# EAGLE design lin.reg.schematic-powerpcb (EAGLE 8.4.0)
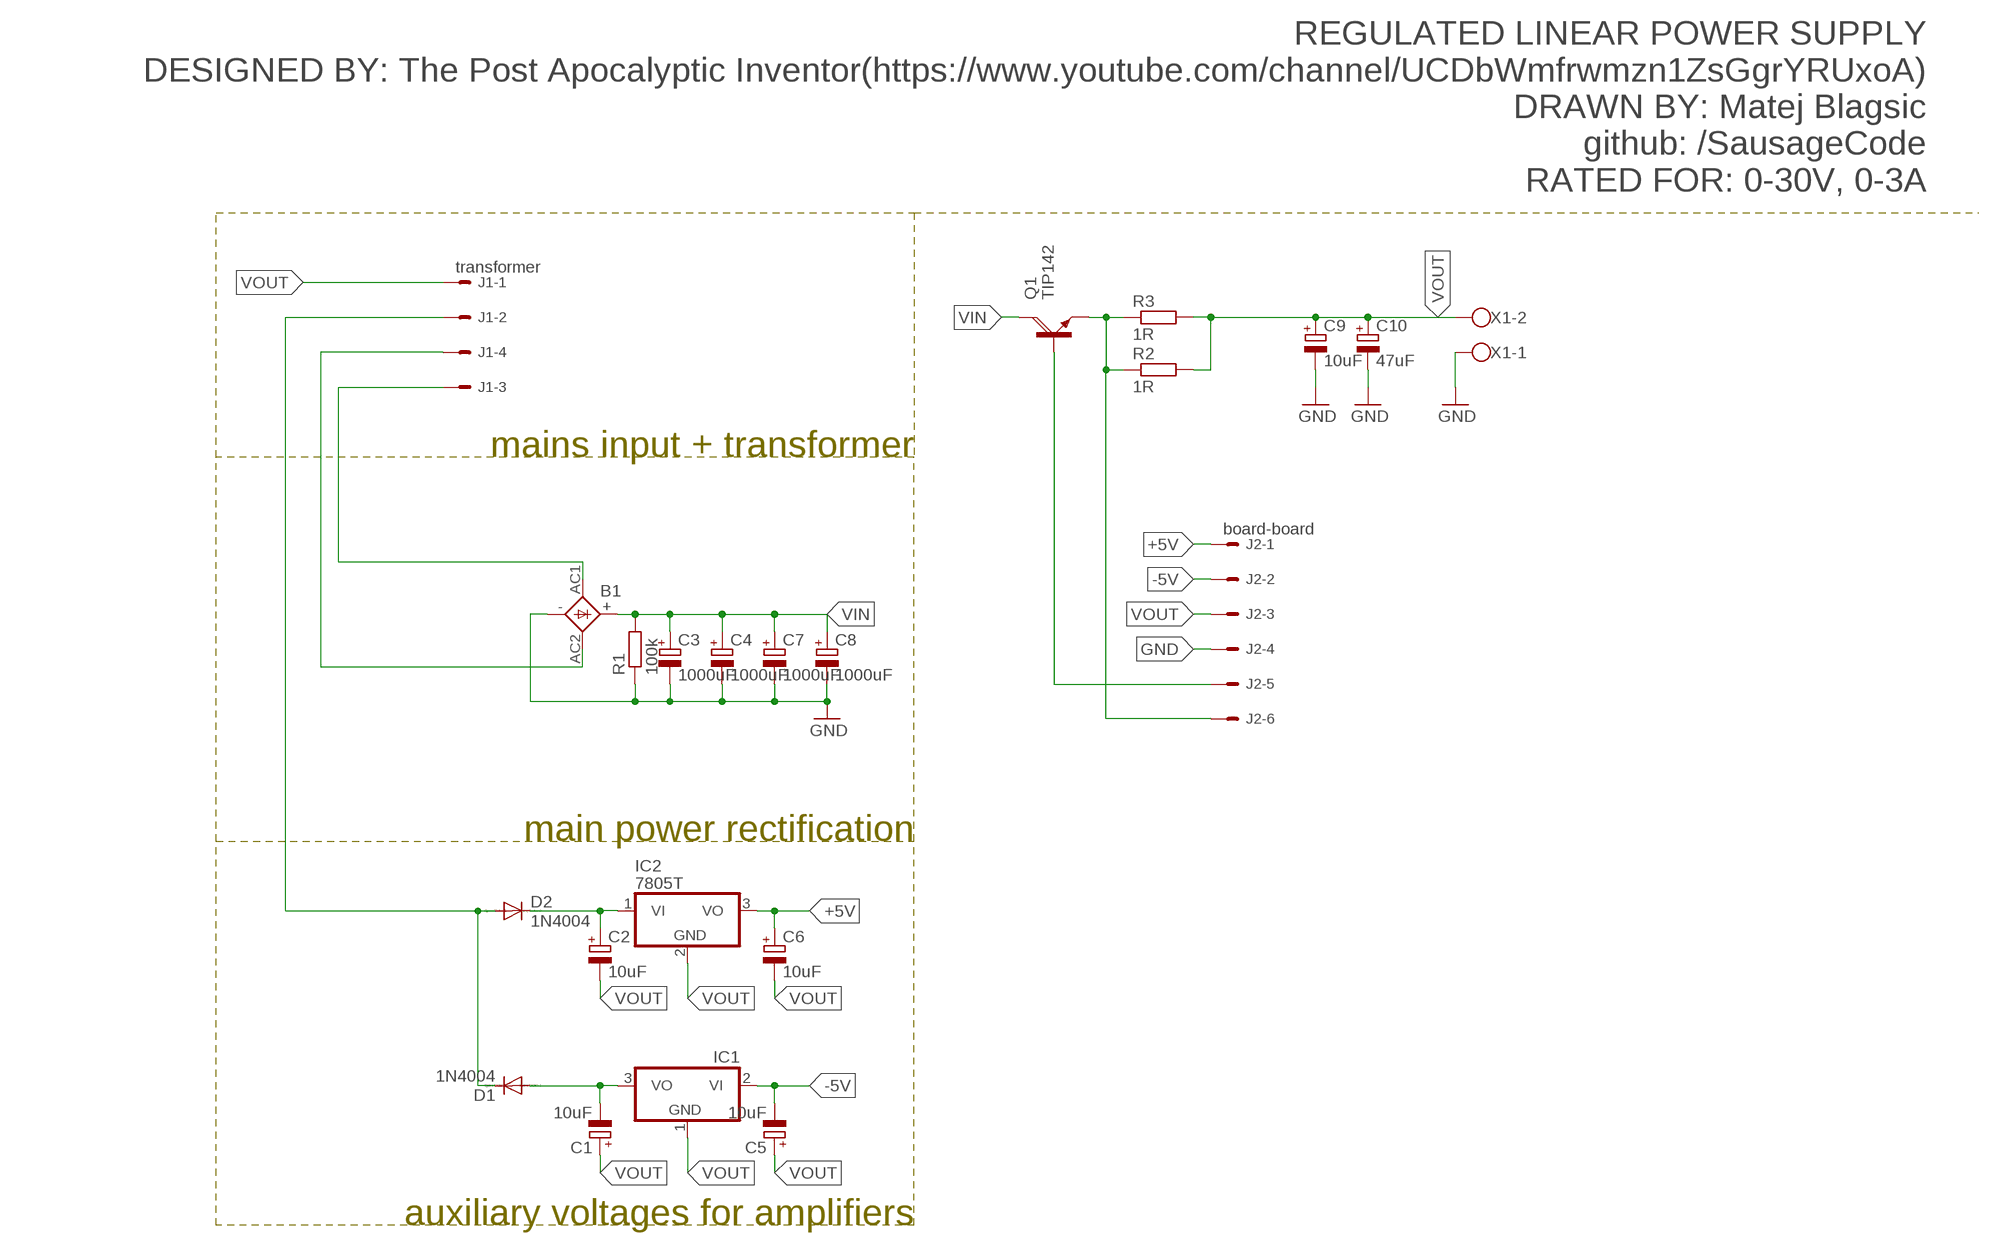
[diagram p0: schematic, sheet 1]

## Parts
B1  2KBB-R  [2KBB-R]
C1  10uF  CPOL-EUE2-5  [E2-5]
C2  10uF  CPOL-EUE2-5  [E2-5]
C3  1000uF  CPOL-EUE5-13  [E5-13]
C4  1000uF  CPOL-EUE5-13  [E5-13]
C5  10uF  CPOL-EUE2-5  [E2-5]
C6  10uF  CPOL-EUE2-5  [E2-5]
C7  1000uF  CPOL-EUE5-13  [E5-13]
C8  1000uF  CPOL-EUE5-13  [E5-13]
C9  10uF  CPOL-EUE2-5  [E2-5]
C10  47uF  CPOL-EUE2-5  [E2-5]
D1  1N4004  [DO41-10]
D2  1N4004  [DO41-10]
IC1  7905T  [TO220H]
IC2  7805T  [TO220H]
J1  transformer  22-27-2041-04  [6410-04]
J2  board-board  22-27-2061-06  [6410-06]
Q1  TIP142  [SOT93]
R1  100k  R-EU_0309/12  [0309/12]
R2  1R  R-EU_0922/22  [0922/22]
R3  1R  R-EU_0922/22  [0922/22]
X1  W237-102  [W237-102]

## Nets
+5V: C6.+ IC2.3(VO) J2.1
-5V: C5.- IC1.2(VI) J2.2
GND: B1.- C3.- C4.- C7.- C8.- C9.- C10.- J2.4 R1.1 X1.1
N$6: J2.6 Q1.E R2.1 R3.1
N$7: J2.5 Q1.B
N$18: C2.+ D2.C IC2.1(VI)
N$21: C1.- D1.A IC1.3(VO)
N$23: D1.C D2.A J1.2
N$24: B1.AC2 J1.4
N$29: B1.AC1 J1.3
VIN: B1.+ C3.+ C4.+ C7.+ C8.+ Q1.C R1.2
VOUT: C1.+ C2.- C5.+ C6.- C9.+ C10.+ IC1.1(GND) IC2.2(GND) J1.1 J2.3 R2.2 R3.2 X1.2

## Notes on the sheet
- REGULATED LINEAR POWER SUPPLY
  DESIGNED BY: The Post Apocalyptic Inventor(https://www.youtube.com/channel/UCDbWmfrwmzn1ZsGgrYRUxoA)
  DRAWN BY: Matej Blagsic
  github: /SausageCode
  RATED FOR: 0-30V, 0-3A
- mains input + transformer
- main power rectification
- auxiliary voltages for amplifiers

## Library data of the parts
B1 = rectifier:2KBB-R: RECTIFIER grid 3 x 5 mm
C1-C10 = rcl:CPOL-EU: POLARIZED CAPACITOR, European symbol
D1 D2 = diode:1N4004: DIODE general purpose rectifier, 1 A
IC1 = linear:79*: Negative VOLTAGE REGULATOR
IC2 = linear:78*: Positive VOLTAGE REGULATOR Source: http://cache.national.com/ds/LM/LM78L05.pdf http://www.fairchildsemi.com/ds/LM/LM7805.pdf
J1 = con-molex:22-?-04: CONNECTOR wire to board 2.54 mm (.1 inch) pitch header; OC_FARNELL: unknown; OC_NEWARK: unknown
J2 = con-molex:22-?-06: CONNECTOR wire to board 2.54 mm (.1 inch) pitch header; OC_FARNELL: unknown; OC_NEWARK: unknown
Q1 = transistor-power:TIP142: NPN DARLINGTON TRANSISTOR
R1 = rcl:R-EU_: RESISTOR, European symbol
R2 R3 = resistor:R-EU_: RESISTOR, European symbol
X1 = con-wago-500:W237-102: WAGO SCREW CLAMP; MPN: 237-102; OC_FARNELL: unknown; OC_NEWARK: 70K9898

## Board
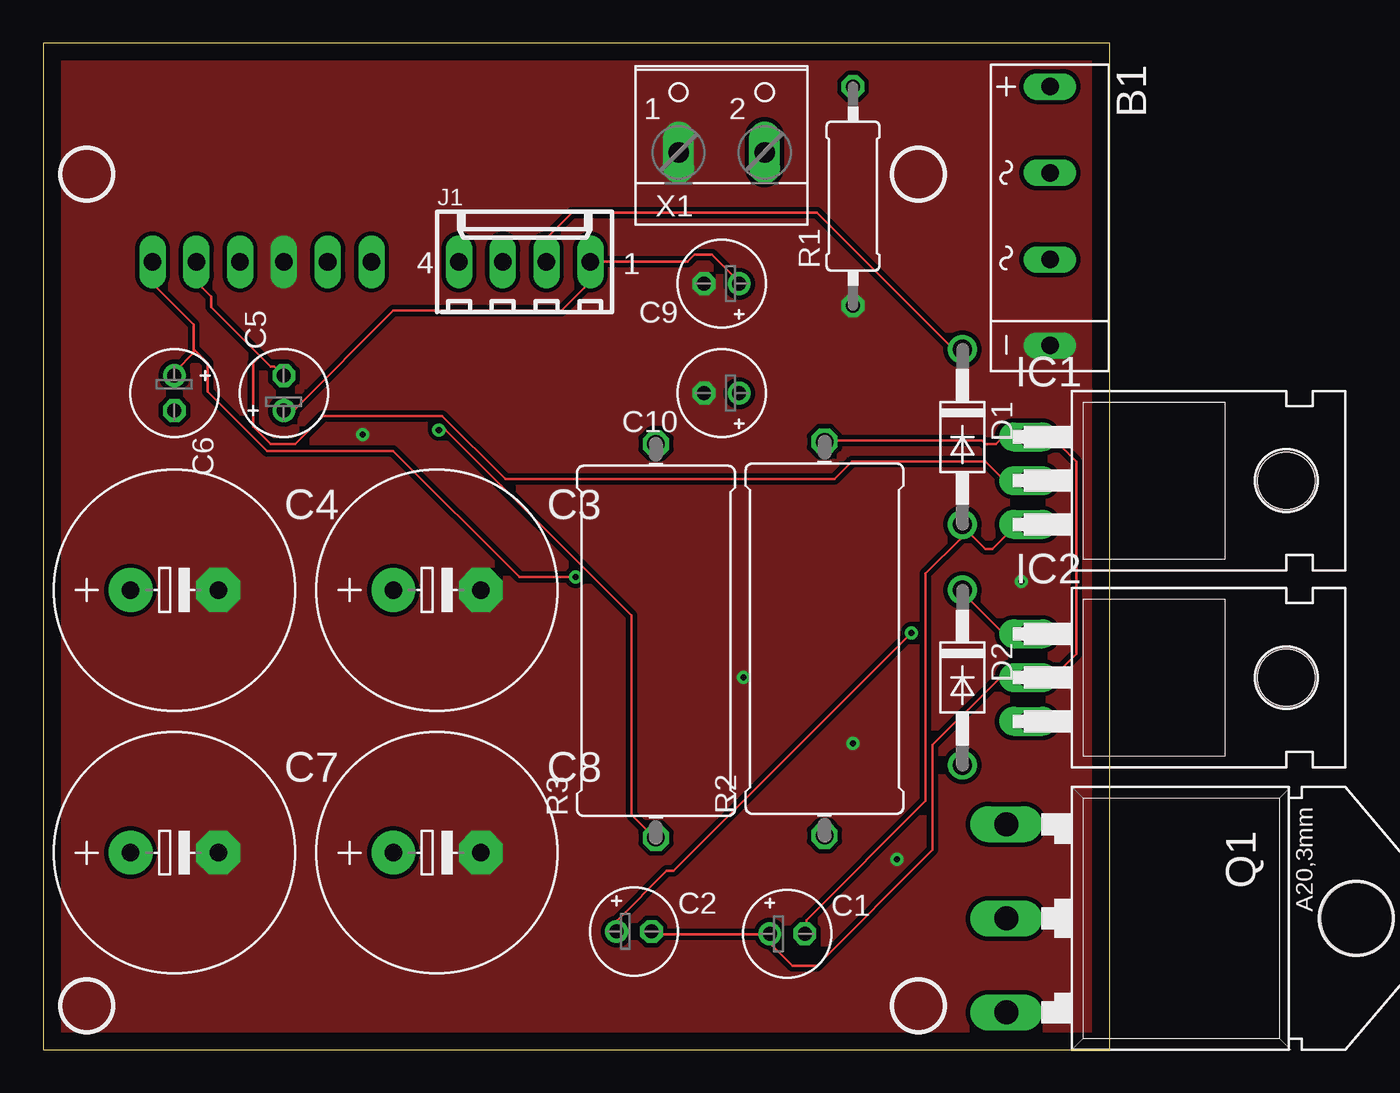
[diagram p1: board, top side]
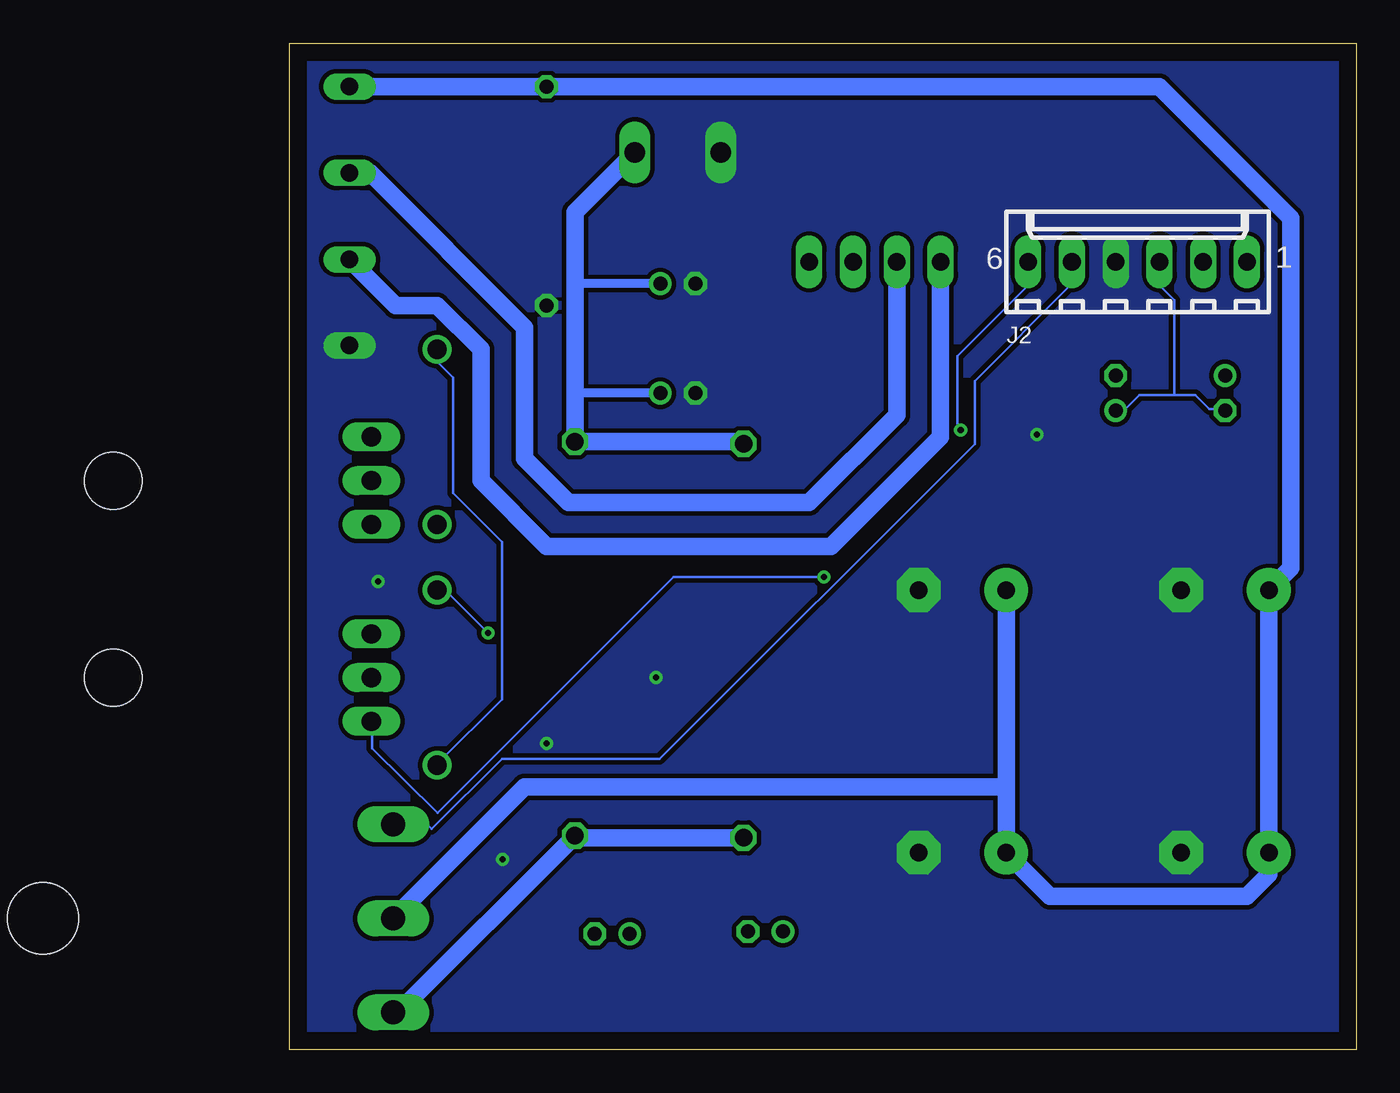
[diagram p2: board, bottom side, seen from below]

Size 61.9 x 58.41 mm. Coordinates in mm from the lower left corner, seen from the top.
Outline: 0,0 61.9,0 61.9,58.41 0,58.41 0,0
Copper layers (1*16): Top 0.035mm / dielectric 1.5mm / Bottom 0.035mm
Design rules "default *": minimum track width 6mil, minimum drill 0.35mm, track to track 10mil, track to pad 10mil, pad to pad 10mil, via to via 10mil, smd to smd 6mil, copper to edge 40mil, drill to drill 6mil, minimum pad ring 10mil, minimum via ring 8mil, stop-mask expansion 4mil, vias tented up to drill 0mil, thermal gap 0mil

### Footprints (pad centres in the part's own frame; a part is rotated, then mirrored left to right if it is on the bottom)
2KBB-R = drill 1.016 long: + -7.62,0; - 7.391,0; AC1 -2.616,0; AC2 2.413,0
E2-5 = drill 0.813 pad 1.27: + -1.016,0 | drill 0.813 pad 1.27 octagon: - 1.016,0
E5-13 = drill 1.016 pad 2.54: + -2.54,0 | drill 1.016 pad 2.54 octagon: - 2.54,0
DO41-10 = drill 1.118: A 5.08,0; C -5.08,0
TO220H = drill 1.118 long: 1 -2.54,-10.16; 2 0,-10.16; 3 2.54,-10.16 | hole 3.302: 0,4.826
6410-04 = drill 1.016 long: 1 3.81,0; 2 1.27,0; 3 -1.27,0; 4 -3.81,0
6410-06 = drill 1.016 long: 1 6.35,0; 2 3.81,0; 3 1.27,0; 4 -1.27,0; 5 -3.81,0; 6 -6.35,0
SOT93 = drill 1.397 long: B -5.461,-10.16; C 0,-10.16; E 5.461,-10.16 | hole 4.115: 0,10.16
0309/12 = drill 0.813 octagon: 1 -6.35,0; 2 6.35,0
0922/22 = drill 1.016 octagon: 1 -11.43,0; 2 11.43,0
W237-102 = drill 1.194 long: 1 -2.5,-1.27; 2 2.5,-1.27

### Placement (x,y rotation side)
B1  58.42,48.26 270 top
C1  43.18,6.73 0 top
C2  34.29,6.86 0 top
C3  22.86,26.67 0 top
C4  7.62,26.67 0 top
C5  13.97,38.1 90 top
C6  7.62,38.1 270 top
C7  7.62,11.43 0 top
C8  22.86,11.43 0 top
C9  39.37,44.45 180 top
C10  39.37,38.1 180 top
D1  53.34,35.56 270 top
D2  53.34,21.59 270 top
IC1  67.31,33.02 270 top
IC2  67.31,21.59 270 top
J1  27.94,45.72 0 top
J2  12.7,45.72 0 bottom
Q1  66.04,7.62 270 top
R1  46.99,49.53 90 top
R2  45.34,23.85 90 top
R3  35.56,23.72 90 top
X1  39.37,53.34 0 top

### Tracks (layer width: path | path; a pad name or v marks a point on that pad's centre or on a via)
+5V  (via drill 0.35)
  Top 0.152: 8.74,40.64 8.74,42.06 6.5,44.3 6.5,45.72 J2.1 | 8.74,40.64 8.74,40.44 7.72,39.42 7.72,39.22 C6.+ | v30.89,27.43 27.64,27.43 20.32,34.75 13.01,34.75 9.55,38.2 9.55,39.83 8.74,40.64
  Bottom 0.152: v30.89,27.43 39.62,27.43 53.31,13.74 57.1,17.48 57.1,18.9 IC2.3
-5V
  Top 0.152: 12.6,40.23 9.75,43.08 9.75,43.69 8.94,44.5 8.94,45.72 J2.2 | 12.6,40.23 13.21,39.62 13.41,39.62 13.82,39.22 C5.- | 12.6,40.23 12.19,39.83 12.19,36.17 13.21,35.15 14.63,35.15 16.26,36.78 23.16,36.78 26.82,33.12 45.92,33.12 46.94,34.14 54.66,34.14 55.68,33.12 57.1,33.12 IC1.2
GND  (via drill 0.35)
  other vias: 46.99,17.78 40.64,21.59 49.53,11.05 56.77,27.18 18.54,35.69
  pour Bottom: 0,58.42 62.23,58.42 62.23,0 0,0
  pour Top: 0,58.42 62.23,58.42 62.23,0 0,0
N$6  (via drill 0.35)
  Top 0.152: v22.96,35.97 23.37,35.97 34.14,25.2 34.14,13.61 35.56,12.19 R3.1
  Bottom 0.152: v22.96,35.97 23.16,36.17 23.16,40.23 19.1,44.3 19.1,45.72 J2.6
  Bottom 1.016: R3.1 45.21,12.29 R2.1 55.6,2.16 Q1.E
N$7
  Bottom 0.152: J2.5 16.66,45.72 16.66,44.3 22.15,38.81 22.15,35.15 40.44,16.87 49.58,16.87 53.65,12.8 53.85,13.01 55.88,13.01 Q1.B
N$18  (via drill 0.35)
  Top 0.152: v50.39,24.18 36.58,10.36 36.17,10.36 33.33,7.52 33.33,6.91 C2.+ | IC2.1 57.1,24.18 55.68,24.18 53.24,26.62 D2.C
  Bottom 0.152: v50.39,24.18 52.83,26.62 53.24,26.62 D2.C
N$21
  Top 0.152: 53.24,29.87 53.24,30.48 D1.A 53.24,29.87 | 53.24,29.87 53.24,29.67 51.21,27.64 51.21,14.43 44.3,7.52 44.3,6.91 C1.- | IC1.3 56.49,30.48 55.07,29.06 54.66,29.06 53.85,29.87 53.24,29.87
N$23
  Top 0.152: D1.C 52.83,40.64 44.91,48.56 30.68,48.56 29.26,47.14 29.26,45.72 J1.2
  Bottom 0.152: D2.A 53.24,16.66 49.58,20.32 49.58,29.46 52.43,32.31 52.43,39.01 53.24,39.83 53.24,40.64 D1.C
N$24
  Bottom 1.016: B1.AC2 55.75,43.18 53.34,43.18 50.8,40.64 50.8,33.02 46.99,29.21 30.48,29.21 24.13,35.56 J1.4
N$29
  Bottom 1.016: J1.3 26.67,36.83 31.75,31.75 45.72,31.75 48.26,34.29 48.26,41.91 57.23,50.88 B1.AC1
VIN
  Bottom 1.016: B1.+ R1.2 11.43,55.88 3.81,48.26 3.81,27.94 C4.+ C7.+ 5.08,10.16 6.35,8.89 17.78,8.89 C8.+ 20.32,15.24 | Q1.C 48.26,15.24 20.32,15.24 | C3.+ 20.32,15.24
VOUT
  Top 0.152: C9.+ 40.44,44.5 38.81,46.13 37.8,46.13 37.39,45.72 J1.1 31.7,45.72 31.7,44.5 30.07,42.88 20.32,42.88 14.63,37.19 14.02,37.19 C5.+ | C2.- 35.36,6.71 42.06,6.71 C1.+ 42.27,6.71 42.27,6.1 43.48,4.88 44.91,4.88 51.61,11.58 51.61,17.68 55.47,21.54 57.1,21.54 IC2.2 57.3,21.74 58.73,21.74 59.94,22.96 59.94,34.14 58.52,35.56 IC1.1 55.68,35.56 55.27,35.15 54.66,35.15 54.46,35.36 45.52,35.36 R2.2
  Bottom 0.152: 10.57,38 12.6,38 13.41,37.19 13.82,37.19 C5.+ | 10.57,38 9.35,38 8.53,37.19 7.72,37.19 C6.- | 10.57,38 10.57,43.48 11.38,44.3 11.38,45.72 J2.3
  Bottom 0.508: C10.+ 45.34,38.1 | C9.+ 45.34,44.45
  Bottom 1.016: R3.2 35.69,35.28 R2.2 45.34,38.1 45.34,44.45 45.34,48.6 X1.2